# Altium project Siwtching_Regulator_LV.PrjPcb
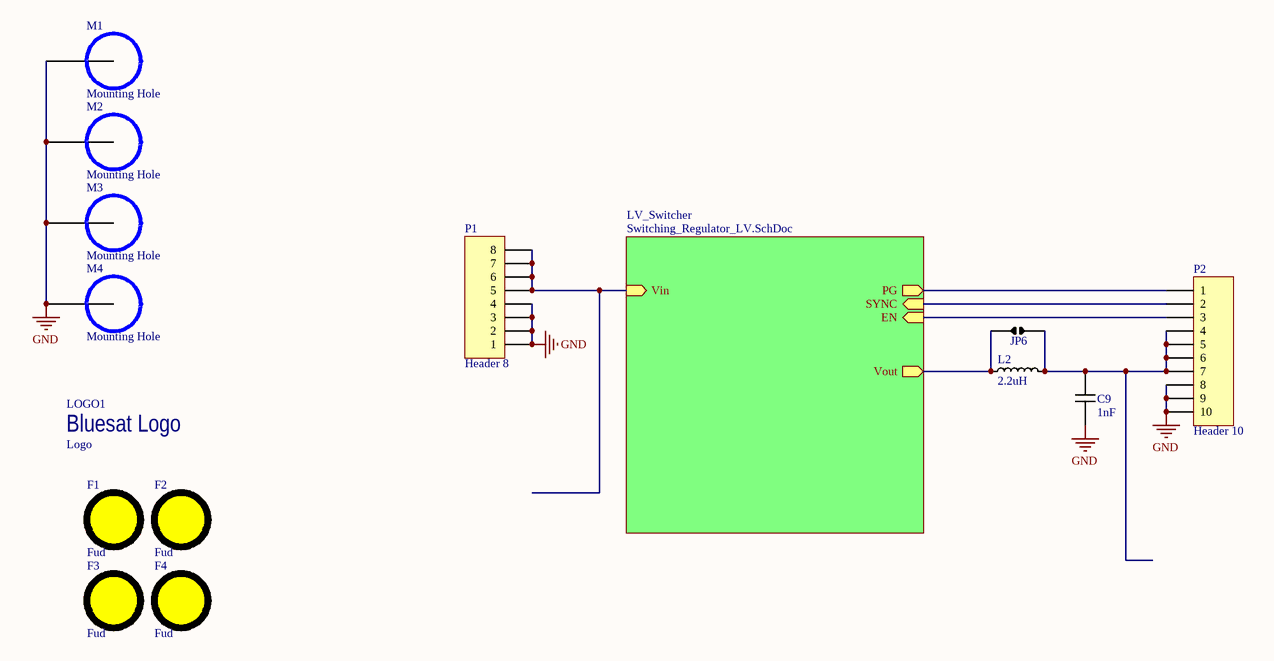
[diagram p0: Switching_Regulator_LV_Board.SchDoc]
1 sheet, 14 parts. Net scope: hierarchical (ports join the sheet entries above them; power ports are global).
Board file: LV_Switcher_PCB.PcbDoc

## Sheet Switching_Regulator_LV_Board.SchDoc
size A4

### Parts
C9  value 1nF  [0805 Cap]  (hidden comment: 0805 Cap)
F1  Fud  [FUd]
F2  Fud  [FUd]
F3  Fud  [FUd]
F4  Fud  [FUd]
JP6  Jumper  [Solder Jumper C]  (value not drawn)
L2  value 2.2uH  [INDP4037X16N]  (hidden comment: LQH44PN2R2MP0)
LOGO1  Logo  [BLUESAT_LOGO]
M1  Mounting Hole  [Mounting_Hole]
M2  Mounting Hole  [Mounting_Hole]
M3  Mounting Hole  [Mounting_Hole]
M4  Mounting Hole  [Mounting_Hole]
P1  Header 8  [HDR1X8]
P2  Header 10  [HDR1X10]

### Sub-sheets
LV_Switcher = Switching_Regulator_LV.SchDoc (file not in this document): PG (out), Vout (out), EN (in), Vin (in), SYNC (in)

### Nets
GND: C9.1 M1.1(SH) M2.1(SH) M3.1(SH) M4.1(SH) P1.1 P1.2 P1.3 P1.4 P2.8 P2.9 P2.10
NetC9_2: C9.2 JP6.2 L2.2 P2.4 P2.5 P2.6 P2.7
NetJP6_1: JP6.1 L2.1 ; sheet LV_Switcher/Vout
NetP1_5: P1.5 P1.6 P1.7 P1.8 ; sheet LV_Switcher/Vin
NetP2_1: P2.1 ; sheet LV_Switcher/PG
NetP2_2: P2.2 ; sheet LV_Switcher/SYNC
NetP2_3: P2.3 ; sheet LV_Switcher/EN

### Library data of the parts
C9 = 0805 MLCC - X7R, 10%
F1-F4 = Fudicial
JP6 = Solder Bridge
L2 = LQH44PN2R2MP0: Inductor 4x4mm 2.2uH; ComponentLink1Description: Datasheet; ComponentLink1URL: http://search.murata.co.jp/Ceramy/image/img/PDF/ENG/L0075S0103LQH44P.pdf
LOGO1 = Bluesat Logo
M1-M4 = Screw Hole
P1 = Header 8: Header, 8-Pin; LatestRevisionDate: 17-Jul-2002; LatestRevisionNote: Re-released for DXP Platform.; Publisher: Altium Limited
P2 = Header 10: Header, 10-Pin; LatestRevisionDate: 17-Jul-2002; LatestRevisionNote: Re-released for DXP Platform.; Publisher: Altium Limited